# Altium schematic sheet MCU+OLED.SchDoc
size A3
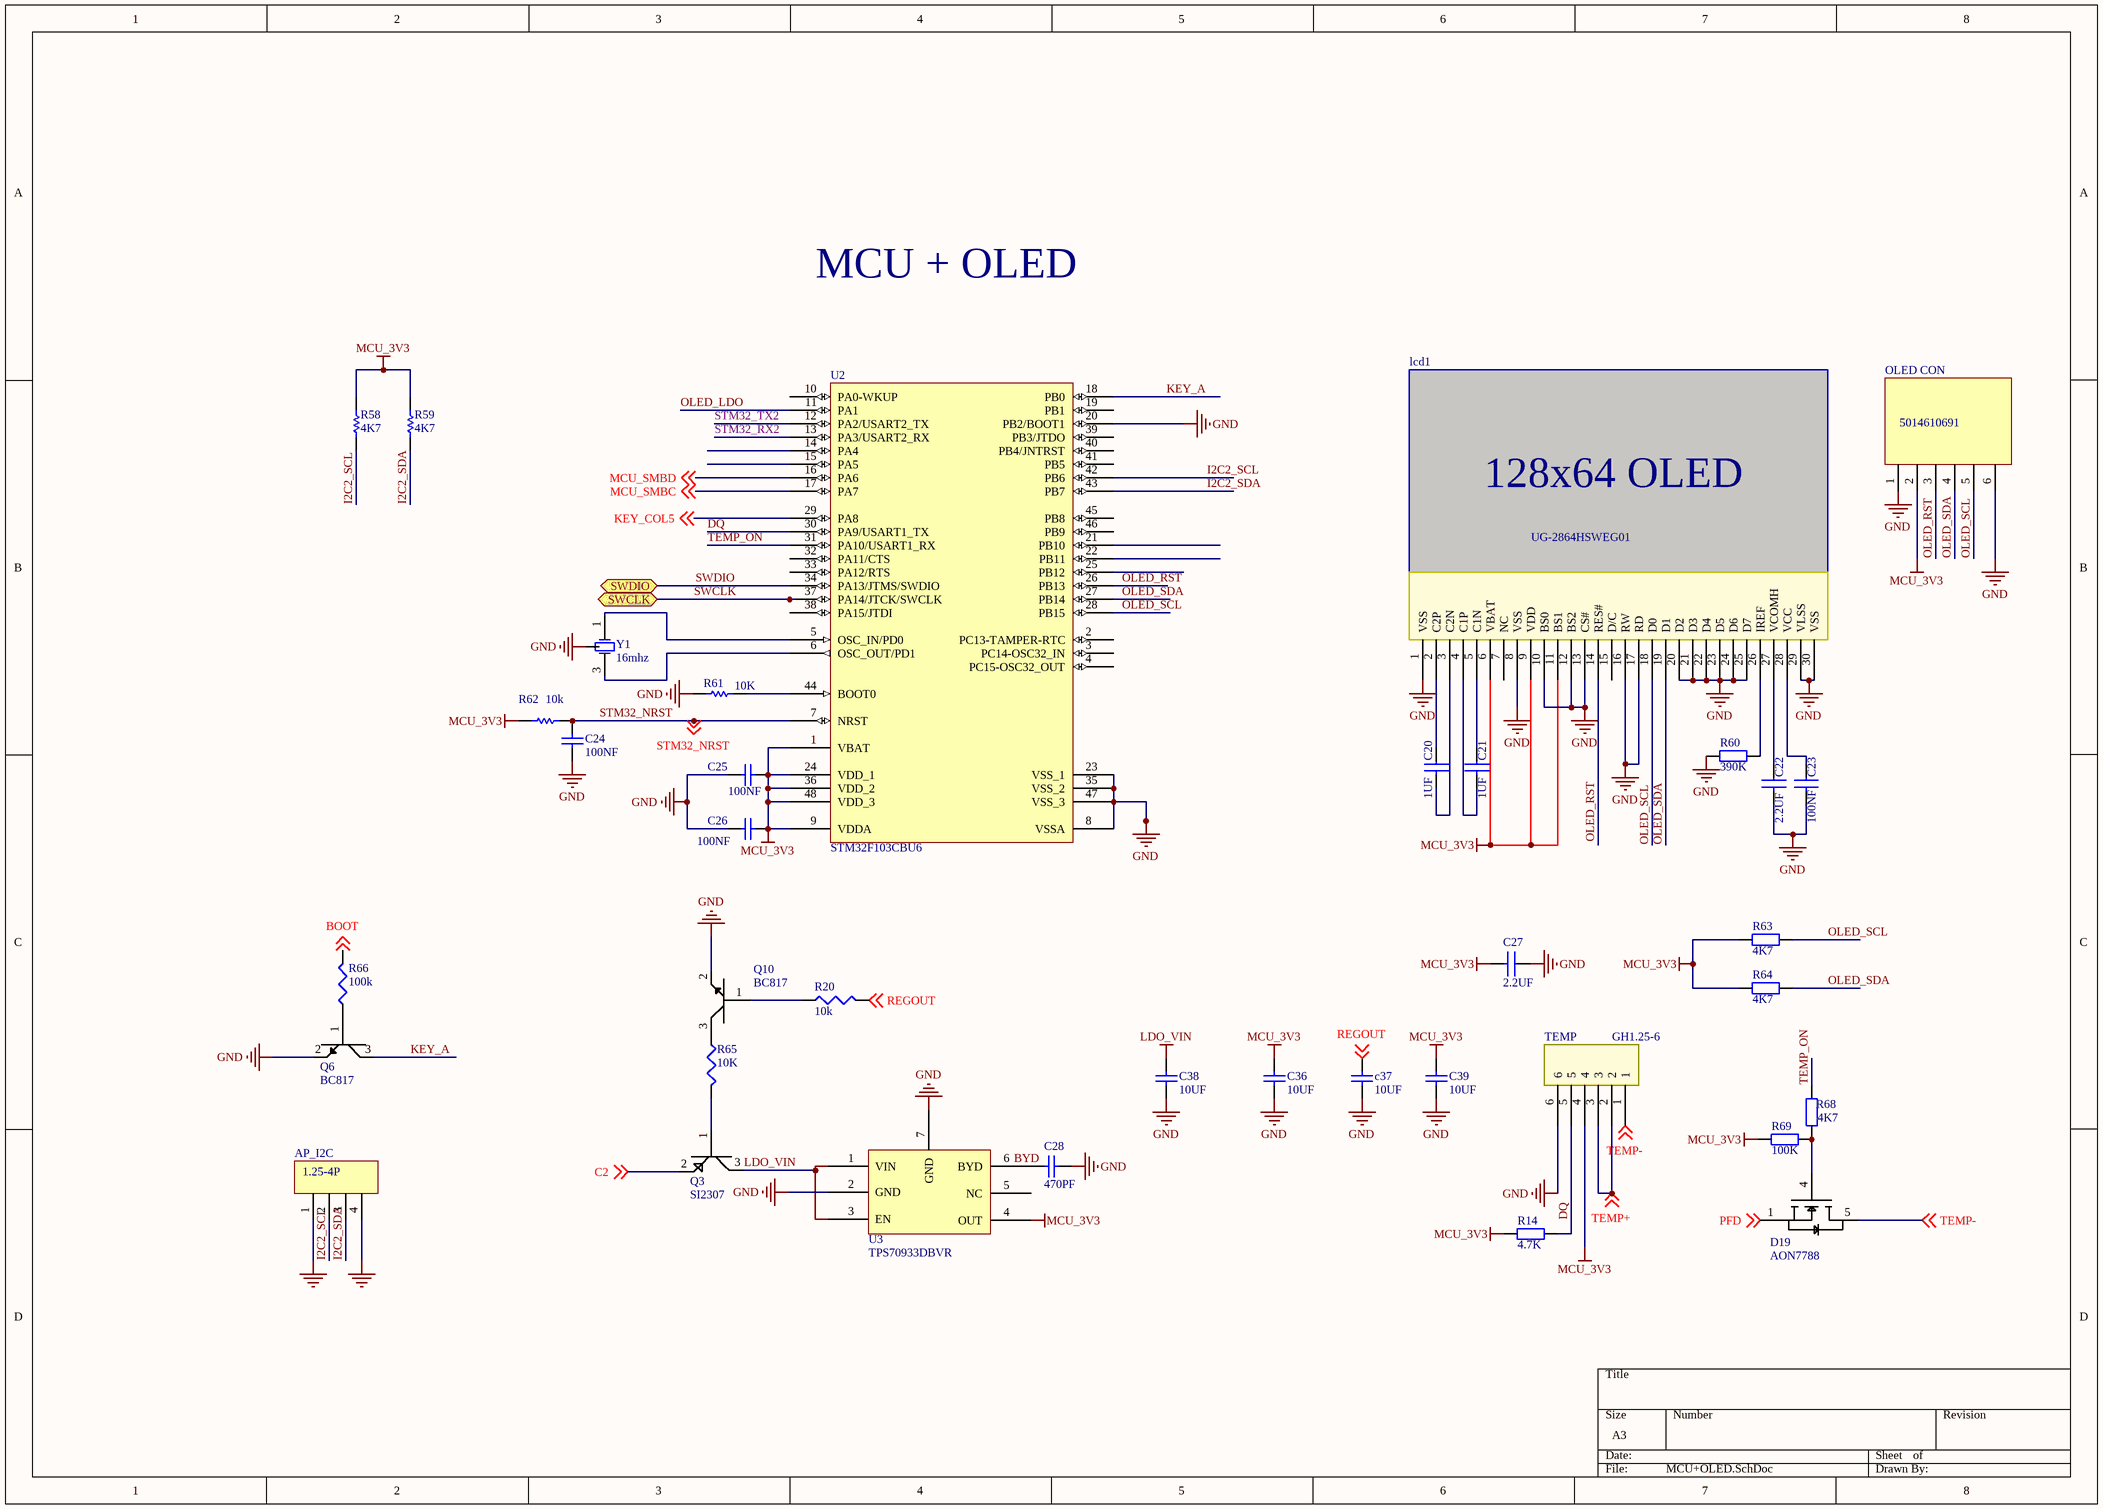
[diagram p0: MCU+OLED.SchDoc]

## Parts
AP_I2C  1.25-4P  [GH1.25-4P]
C20  1UF  [0603c]
C21  1UF  [0603c]
C22  2.2UF  [0603c]
C23  100NF  [0603c]
C24  100nf  [0402CAP]
C25  value 100NF  [0402CAP]  (hidden comment: Cap)
C26  value 100NF  [0402CAP]  (hidden comment: Cap)
C27  2.2UF  [0603c]
C28  470PF  [0402CAP]
C36  10UF  [0805CAP]
c37  10UF  [0805CAP]
C38  10UF  [0805CAP]
C39  10UF  [0805CAP]
D19  AON7788  [DFN3x3_8L]
lcd1  UG-2864HSWEG01  [1.3OLED]
OLED_CON  5014610691  [5014610691]
Q3  SI2307  [SOT-23 - duplicate]
Q6  BC817  [SOT-23 - duplicate]
Q10  BC817  [SOT-23 - duplicate]
R14  4.7K  [0402r]
R20  10k  [0402R]
R58  4K7  [0402R]
R59  4K7  [0402R]
R60  390K  [0402r]
R61  10K  [0402R]
R62  10k  [0402R]
R63  4K7  [0402r]
R64  4K7  [0402r]
R65  10K  [0402r]
R66  100k  [0402r]
R68  4K7  [0402r]
R69  100K  [0402r]
TEMP  GH1.25-6  [GH1.25-6]
U2  STM32F103CBU6  [QFN48]
U3  TPS70933DBVR  [MLF-6]
Y1  16mhz  [RESONATOR]

## Ports
SWCLK, SWDIO

## Nets
GND: AP_I2C.1 AP_I2C.4 C22.2 C23.2 C24.2 C25.1 C26.1 C27.1 C28.2 C36.1 c37.1 C38.1 C39.1 lcd1.1(VSS) lcd1.8(VSS) lcd1.10(BS0) lcd1.12(BS2) lcd1.13(CS#) lcd1.16(RW) lcd1.17(RD) lcd1.20(D2) lcd1.21(D3) lcd1.22(D4) lcd1.23(D5) lcd1.24(D6) lcd1.25(D7) lcd1.29(VLSS) lcd1.30(VSS) OLED_CON.1 OLED_CON.6 Q6.2(emitter) Q10.2(emitter) R60.1 R61.2 TEMP.6 U2.8(VSSA) U2.20(PB2/BOOT1) U2.23(VSS_1) U2.35(VSS_2) U2.47(VSS_3) U3.2(GND) U3.7(GND) Y1.2(GND)
LDO_VIN: C38.2 Q3.3(collector) U3.1(VIN) U3.3(EN)
MCU_3V3: C25.2 C26.2 C27.2 C36.2 C39.2 lcd1.6(VBAT) lcd1.9(VDD) lcd1.11(BS1) OLED_CON.2 R14.1 R58.1 R59.1 R62.2 R63.1 R64.1 R69.2 TEMP.4 U2.1(VBAT) U2.9(VDDA) U2.24(VDD_1) U2.36(VDD_2) U2.48(VDD_3) U3.4(OUT)
BOOT: R66.2 ; off-sheet BOOT
C2: Q3.2(emitter) ; off-sheet C2
DQ: R14.2 TEMP.5 U2.30(PA9/USART1_TX)
I2C2_SCL: AP_I2C.2 R58.2 U2.42(PB6)
I2C2_SDA: AP_I2C.3 R59.2 U2.43(PB7)
KEY_A: Q6.3(collector) U2.18(PB0)
KEY_COL5: U2.29(PA8) ; off-sheet KEY_COL5
MCU_SMBC: U2.17(PA7) ; off-sheet MCU_SMBC
MCU_SMBD: U2.16(PA6) ; off-sheet MCU_SMBD
OLED_LDO: U2.11(PA1)
OLED_RST: lcd1.14(RES#) OLED_CON.3 U2.26(PB13)
OLED_SCL: lcd1.18(D0) OLED_CON.5 R63.2 U2.28(PB15)
OLED_SDA: lcd1.19(D1) OLED_CON.4 R64.2 U2.27(PB14)
PFD: D19.1(S) ; off-sheet PFD
REGOUT: c37.2 R20.2 ; off-sheet REGOUT
STM32_NRST: C24.1 R62.1 U2.7(NRST) ; off-sheet STM32_NRST
STM32_RX2: U2.13(PA3/USART2_RX)
STM32_TX2: U2.12(PA2/USART2_TX)
SWCLK: U2.37(PA14/JTCK/SWCLK) ; port SWCLK
SWDIO: U2.34(PA13/JTMS/SWDIO) ; port SWDIO
TEMP+: TEMP.2 TEMP.3 ; off-sheet TEMP+
TEMP-: D19.5(D) TEMP.1 ; off-sheet TEMP-
TEMP_ON: R68.2 U2.31(PA10/USART1_RX)
NetC20_1: C20.1 lcd1.2(C2P)
NetC20_2: C20.2 lcd1.3(C2N)
NetC21_1: C21.1 lcd1.5(C1N)
NetC21_2: C21.2 lcd1.4(C1P)
NetC22_1: C22.1 lcd1.27(VCOMH)
NetC23_1: C23.1 lcd1.28(VCC)
NetC28_1: C28.1 U3.6(BYD)
NetD19_4: D19.4(G) R68.1 R69.1
Netlcd1_26: lcd1.26(IREF) R60.2
NetQ3_1: Q3.1(base) R65.2
NetQ6_1: Q6.1(base) R66.1
NetQ10_1: Q10.1(base) R20.1
NetQ10_3: Q10.3(collector) R65.1
NetR61_1: R61.1 U2.44(BOOT0)
NetU2_5: U2.5(OSC_IN/PD0) Y1.1(OSC1)
NetU2_6: U2.6(OSC_OUT/PD1) Y1.3(OSC2)

Not connected (* = marked no-connect by the designer): lcd1 7(NC) 15(D/C); U2 2(PC13-TAMPER-RTC) 3(PC14-OSC32_IN) 4(PC15-OSC32_OUT) 10(PA0-WKUP) 14(PA4) 15(PA5) 19(PB1) 21(PB10) 22(PB11) 25(PB12) 32(PA11/CTS) 33(PA12/RTS) 38(PA15/JTDI) 39(PB3/JTDO) 40(PB4/JNTRST) 41(PB5) 45(PB8) 46(PB9); U3 5(NC)

## Notes on the sheet
- MCU + OLED
- Labels drawn without touching a wire or pin: BYD
- (in symbol UG-2864HSWEG01) 128x64 OLED

## Library data of the parts
C20-C22 C27 = C1005X5R1H104K: CAP CER .10UF 50V X5R 10% 0402; Manufacturer: TDK Corporation; Capacitance: 0.1礔; Value: 100nF; .Checked PCB: used; Tolerance: ?0%; Category: Capacitors; Supplier Part Number: 445-5942-1-ND; Manufacturer Part Number: C1005X5R1H104K; Operating Temperature: -55癈 ~ 85癈; Package / Case: 0402 (1005 Metric); Price 1k [$]: 0.02340; .Checked SCH: used; Voltage - Rated: 50V; Supplier: Digikey; Supplier 1: Digi-Key; Supplier Part Number 1: 445-5942-1-ND; RoHS: RoHS Compliant; Stock 1: 106926; Pricing 1: 1=0.27, 10=0.18, 100=0.072, 250=0.05176, 500=0.0369, 1000=0.027 (USD); Temperature Coefficient: X5R; Mounting Type: Surface Mount, MLCC; Applications: General Purpose; Ratings: -; Size / Dimension: 0.039" L x 0.020" W (1.00mm x 0.50mm); Height - Seated (Max): -; Thickness (Max): 0.022" (0.55mm); Lead Spacing: -; Features: -; Packaging: Cut Tape (CT); Lead Style: -; ComponentLink1URL: http://www.tdk.co.jp/tefe02/e412_c.pdf; ComponentLink1Description: http://www.tdk.co.jp/tefe02/e412_c.pdf
C23 = C1005X5R1H104K: CAP CER .10UF 50V X5R 10% 0402; Manufacturer: TDK Corporation; Capacitance: 0.1礔; .Checked PCB: used; Tolerance: ?0%; Category: Capacitors; Supplier Part Number: 445-5942-1-ND; Manufacturer Part Number: C1005X5R1H104K; Operating Temperature: -55癈 ~ 85癈; Package / Case: 0402 (1005 Metric); Price 1k [$]: 0.02340; Value: 100nF; .Checked SCH: used; Voltage - Rated: 50V; Supplier: Digikey; Supplier 1: Digi-Key; Supplier Part Number 1: 445-5942-1-ND; RoHS: RoHS Compliant; Stock 1: 106926; Pricing 1: 1=0.27, 10=0.18, 100=0.072, 250=0.05176, 500=0.0369, 1000=0.027 (USD); Temperature Coefficient: X5R; Mounting Type: Surface Mount, MLCC; Applications: General Purpose; Ratings: -; Size / Dimension: 0.039" L x 0.020" W (1.00mm x 0.50mm); Height - Seated (Max): -; Thickness (Max): 0.022" (0.55mm); Lead Spacing: -; Features: -; Packaging: Cut Tape (CT); Lead Style: -; ComponentLink1URL: http://www.tdk.co.jp/tefe02/e412_c.pdf; ComponentLink1Description: http://www.tdk.co.jp/tefe02/e412_c.pdf
C24-C26 = Cap: Capacitor; Published: 8-Jun-2000; LatestRevisionDate: 17-Jul-2002; LatestRevisionNote: Re-released for DXP Platform.; PackageReference: RAD-0.3; Publisher: Altium Limited; PackageDescription: Radial Cap, Thru-Hole; 2 Leads; 0.3 in Pin Spacing
  C24: Value: 100NF
C28 = Cap: Capacitor; Value: 100pF; Published: 8-Jun-2000; LatestRevisionDate: 17-Jul-2002; LatestRevisionNote: Re-released for DXP Platform.; PackageReference: RAD-0.3; Publisher: Altium Limited; PackageDescription: Radial Cap, Thru-Hole; 2 Leads; 0.3 in Pin Spacing
C36 c37 C38 C39 = Cap: Value: 100pF; Published: 8-Jun-2000; LatestRevisionDate: 17-Jul-2002; LatestRevisionNote: Re-released for DXP Platform.; PackageReference: RAD-0.3; Publisher: Altium Limited; PackageDescription: Radial Cap, Thru-Hole; 2 Leads; 0.3 in Pin Spacing
Q3 = MMBT3906
Q6 Q10 = BC718
R14 R60 R63 R64 R68 R69 = Res2: Resistor; Value: 1K; Published: 8-Jun-2000; LatestRevisionDate: 17-Jul-2002; LatestRevisionNote: Re-released for DXP Platform.; PackageReference: AXIAL-0.4; Publisher: Altium Limited; PackageDescription: Axial Device, Thru-Hole; 2 Leads; 0.4 in Pin Spacing
R20 R65 R66 = RMCF0402FT4K99: RES TF 4.99K OHM 1% 1/16W 0402; Manufacturer: Stackpole Electronics Inc; Power (Watts): 0.063W, 1/16W; Tolerance: ?%; Value: 4k99; .Checked PCB: used; Temperature Coefficient: ?00ppm/癈; Category: Resistors; Supplier Part Number: RMCF0402FT4K99CT-ND; Manufacturer Part Number: RMCF0402FT4K99; Package / Case: 0402 (1005 Metric); Price 1k [$]: 0.00384; Resistance (Ohms): 4.99K; .Checked SCH: used; Supplier: Digikey; Supplier 1: Digi-Key; Supplier Part Number 1: RMCF0402FT4K99CT-ND; RoHS: RoHS Compliant; Stock 1: 48509; Pricing 1: 1=0.04, 10=0.025, 50=0.0138, 100=0.0105, 250=0.0078, 500=0.00576, 1000=0.00384 (USD); Composition: Thick Film; Features: -; Size / Dimension: 0.039" L x 0.020" W (1.00mm x 0.50mm); Height: 0.016" (0.40mm); Number of Terminations: 2; Packaging: Cut Tape (CT); ComponentLink1URL: http://www.seielect.com/Catalog/SEI-RMCF.pdf; ComponentLink1Description: http://www.seielect.com/Catalog/SEI-RMCF.pdf
R58 R59 R61 R62 = Res Semi: Semiconductor Resistor; Published: 8-Jun-2000; LatestRevisionDate: 17-Jul-2002; LatestRevisionNote: Re-released for DXP Platform.; PackageReference: AXIAL-0.5; Publisher: Altium Limited; PackageDescription: Axial Device, Thru-Hole; 2 Leads; 0.5 in Pin Spacing
  R61: Value: 10K
U2 = STM32F103C8T6: STM32 ARM-based 32-bit MCU with 64 Kbytes Flash, 48-pin LQFP, Industrial Temperature; Published: 30-May-2008; DatasheetVersion: rev6, Mar-2008; PackageVersion: Mar-2008; PackageReference: LQFP48; Publisher: Altium Limited; PackageDescription: 48-Pin Low-Profile Quad Flat Pack, 7 x 7 mm Body, 0.5 mm Pitch (LQFP48); ComponentLink1Description: Manufacturer Link; ComponentLink1URL: www.st.com/stm32; ComponentLink2Description: Datasheet; ComponentLink2URL: http://www.st.com/stonline/products/literature/ds/13587.pdf
U3 = MIC5219-3V3
Y1 = XTAL: Crystal Oscillator; Published: 8-Jun-2000; LatestRevisionDate: 17-Jul-2002; LatestRevisionNote: Re-released for DXP Platform.; PackageReference: R38; Publisher: Altium Limited; PackageDescription: Crystal, Thru-Hole; 2 Leads; Body 3.1 x 8.2 mm (Dia.xH)